# EAGLE design HiJack_Programmer (EAGLE 5.09)
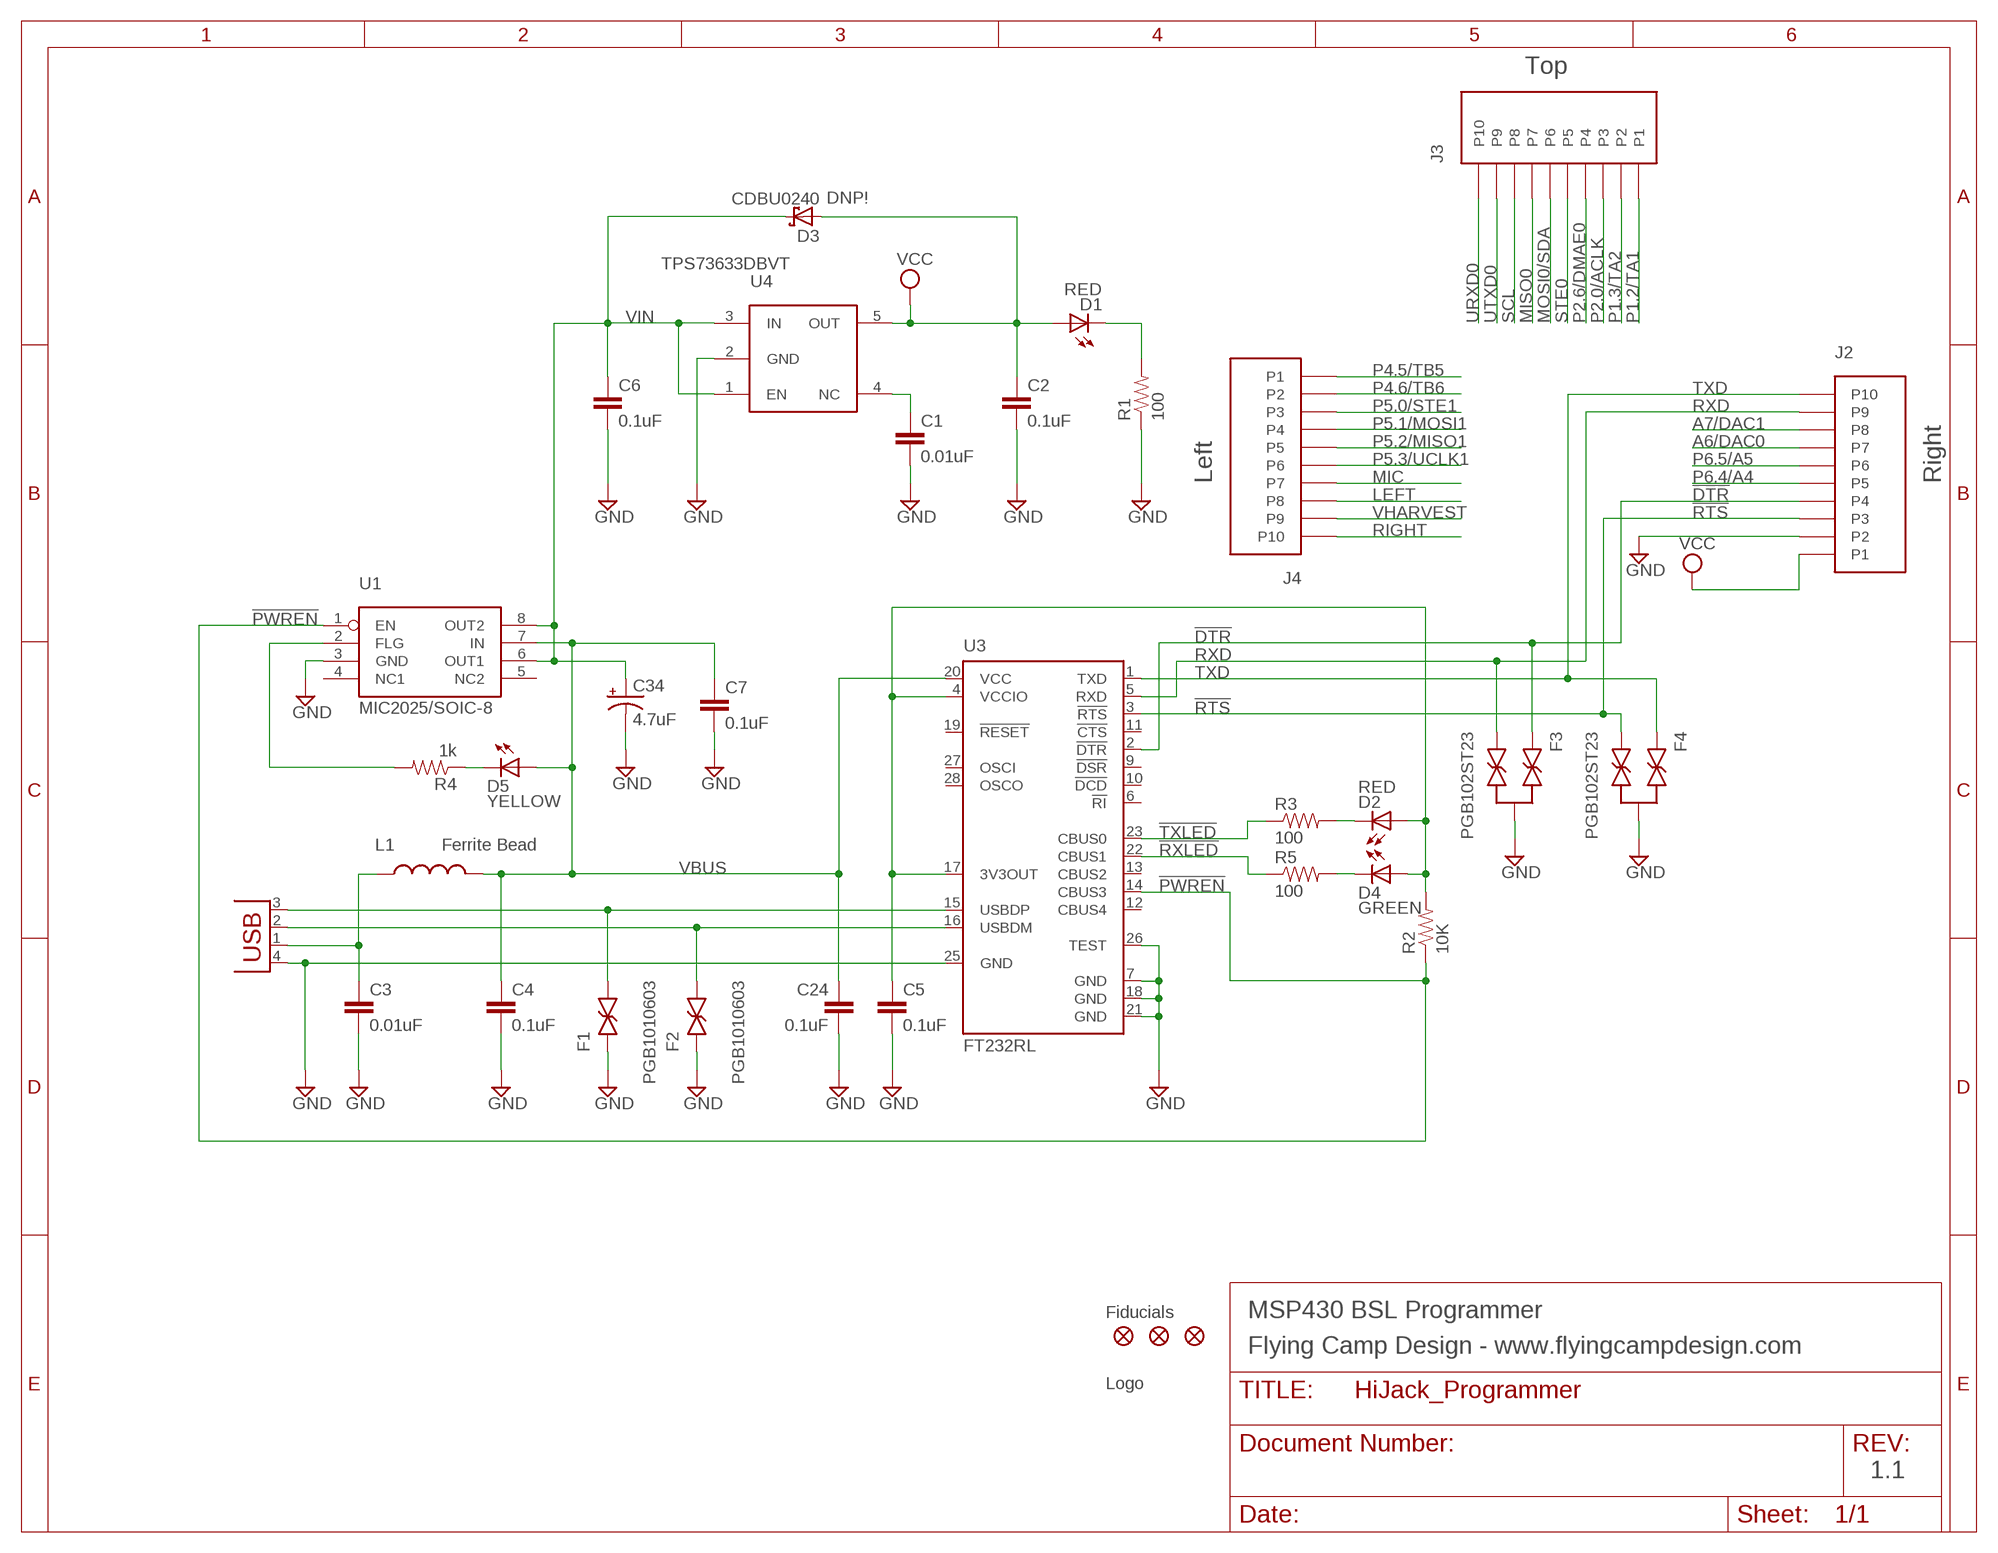
[diagram p0: schematic, sheet 1]

## Parts
C1  0.01uF  CAPACITOR1608  [CAPC1608]
C2  0.1uF  CAPACITOR1608  [CAPC1608]
C3  0.01uF  CAPACITOR1608  [CAPC1608]
C4  0.1uF  CAPACITOR1608  [CAPC1608]
C5  0.1uF  CAPACITOR1608  [CAPC1608]
C6  0.1uF  CAPACITOR1608  [CAPC1608]
C7  0.1uF  CAPACITOR1608  [CAPC1608]
C24  0.1uF  CAPACITOR1608  [CAPC1608]
C34  4.7uF  CAP_POL1206  [EIA3216]
D1  RED  LED1608  [LEDC1608]
D2  RED  LED1608  [LEDC1608]
D3  CDBU0240  SCHOTTKY-DIODE0603  [D0603]
D4  GREEN  LED1608  [LEDC1608]
D5  YELLOW  LED1608  [LEDC1608]
F1  PGB1010603  LITTELFUSE_PGB1010603  [CAPC1608]
F2  PGB1010603  LITTELFUSE_PGB1010603  [CAPC1608]
F3  PGB102ST23  LITTELFUSE_PGB102ST23  [SOT23]
F4  PGB102ST23  LITTELFUSE_PGB102ST23  [SOT23]
J2  HEADER10POS  [10PIN2MMHEADER]
J3  HEADER10POS  [10PIN2MMHEADER]
J4  HEADER10POS  [10PIN2MMHEADER]
L1  Ferrite Bead  INDUCTOR0603  [0603]
P1  MOLEX_48037-1000  [MOLEX_48037-1000]
R1  100  RESISTOR1608  [RESC1608]
R2  10K  RESISTOR1608  [RESC1608]
R3  100  RESISTOR1608  [RESC1608]
R4  1k  RESISTOR1608  [RESC1608]
R5  100  RESISTOR1608  [RESC1608]
U1  MIC2025/SOIC-8  [SOIC-8]
U3  FT232RL  [SSOP28]
U4  TPS73633DBVT  MIC5235SOT95P280-5  [SOT95P280-5]
U$2  FIDUCIAL1X2  [FIDUCIAL-1X2]
U$3  FIDUCIAL1X2  [FIDUCIAL-1X2]
U$4  FIDUCIAL1X2  [FIDUCIAL-1X2]

## Nets
!DTR: F3.1 J2.P4 U3.2(!DTR)
!PWREN: R2.1 U1.1(EN) U3.14(CBUS3)
!RTS: F4.2 J2.P3 U3.3(!RTS)
!RXLED: R5.1 U3.22(CBUS1)
!TXLED: R3.1 U3.23(CBUS0)
A6/DAC0: J2.P7
A7/DAC1: J2.P8
D+: F1.2 P1.3(D+) U3.15(USBDP)
D-: F2.2 P1.2(D-) U3.16(USBDM)
GND [power]: C1.2 C2.2 C3.2 C4.2 C5.2 C6.2 C7.2 C24.2 C34.C(-) F1.1 F2.1 F3.3 F4.3 J2.P2 P1.4(GND) R1.1 U1.3(GND) U3.7(GND) U3.18(GND) U3.21(GND) U3.25(GND) U3.26(TEST) U4.2(GND)
LEFT: J4.P8
MIC: J4.P7
MISO0: J3.P7
MOSI0/SDA: J3.P6
N$1: D1.C R1.2
N$2: C1.1 U4.4(NC)
N$3: R4.2 U1.2(FLG)
N$4: D5.C R4.1
N$34: D2.C R3.2
N$35: D4.C R5.2
P1.2/TA1: J3.P1
P1.3/TA2: J3.P2
P2.0/ACLK: J3.P3
P2.6/DMAE0: J3.P4
P4.5/TB5: J4.P1
P4.6/TB6: J4.P2
P5.0/STE1: J4.P3
P5.1/MOSI1: J4.P4
P5.2/MISO1: J4.P5
P5.3/UCLK1: J4.P6
P6.4/A4: J2.P5
P6.5/A5: J2.P6
RIGHT: J4.P10
RXD: F3.2 J2.P9 U3.5(RXD)
SCL: J3.P8
STE0: J3.P5
TXD: F4.1 J2.P10 U3.1(TXD)
URXD0: J3.P10
UTXD0: J3.P9
VBUS: C4.1 C7.1 C24.1 D5.A L1.2 U1.7(IN) U3.20(VCC)
VCC: C2.1 D1.A D3.A J2.P1 U4.5(OUT)
VCCIO: C5.1 D2.A D4.A R2.2 U3.4(VCCIO) U3.17(3V3OUT)
VHARVEST: J4.P9
VIN: C6.1 C34.A(+) D3.C U1.6(OUT1) U1.8(OUT2) U4.1(EN) U4.3(IN)
VUSB: C3.1 L1.1 P1.1(VBUS)
Unconnected: U1.4(NC1) U1.5(NC2) U3.6(!RI) U3.9(!DSR) U3.10(!DCD) U3.11(!CTS) U3.12(CBUS4) U3.13(CBUS2) U3.19(!RESET) U3.27(OSCI) U3.28(OSCO)

## Notes on the sheet
- Top
- DNP!
- Left | Right
- Fiducials | MSP430 BSL Programmer
- Flying Camp Design - www.flyingcampdesign.com
- Logo
- 1.1

## Library data of the parts
C1-C7 C24 = cwilson:CAPACITOR: Capacitor
C34 = SparkFun:CAP_POL: Capacitor Polarized These are standard SMD and PTH capacitors. Normally 10uF, 47uF, and 100uF in electrolytic and tantalum varieties. Always verify the external diameter of the through hole cap, it varies with capacity, voltage, and manufacturer. The EIA devices should be standard.
D1 D2 D4 D5 = cwilson:LED: LED
D3 = cwilson-old:SCHOTTKY-DIODE: Schottky Diode
F1 F2 = cwilson:LITTELFUSE_PGB1010603
F3 F4 = cwilson-old:LITTELFUSE_PGB102ST23
J2-J4 = hijack:HEADER10POS: Fits 3M 950510-6102-AR
L1 = SparkFun:INDUCTOR: Inductors Basic Inductor/Choke - 0603 and 1206. Footprints are not proven and vary greatly between part numbers.
P1 = cwilson-old:MOLEX_48037-1000
R1-R5 = cwilson:RESISTOR: Resistor
U1 = cwilson-old:MIC2025
U3 = cwilson-old:FT232R: Source: http://www.ftdichip.com/Documents/DataSheets/DS_FT232R_v104.pdf
U4 = cwilson:MIC5235
U$2-U$4 = SparkFun:FIDUCIAL: Fiducial Alignment Points Various fiducial points for machine vision alignment.

## Net classes
1 power: width 0.635 mm, clearance 0.406 mm

## Board
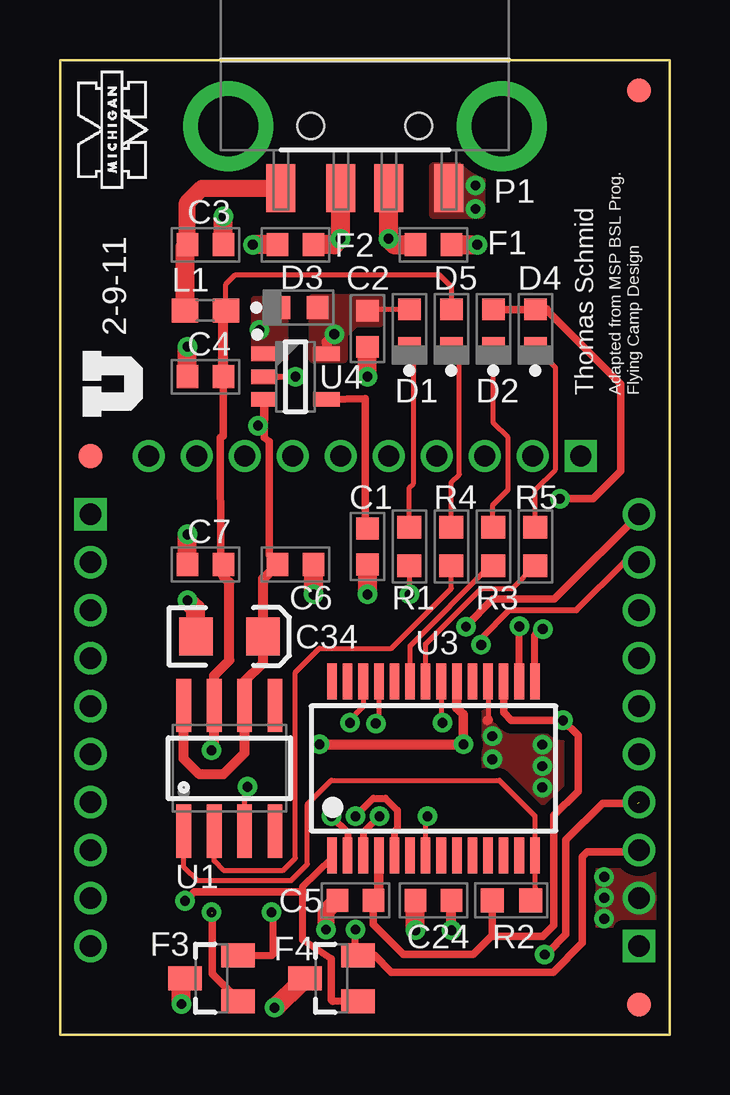
[diagram p1: board, top side]
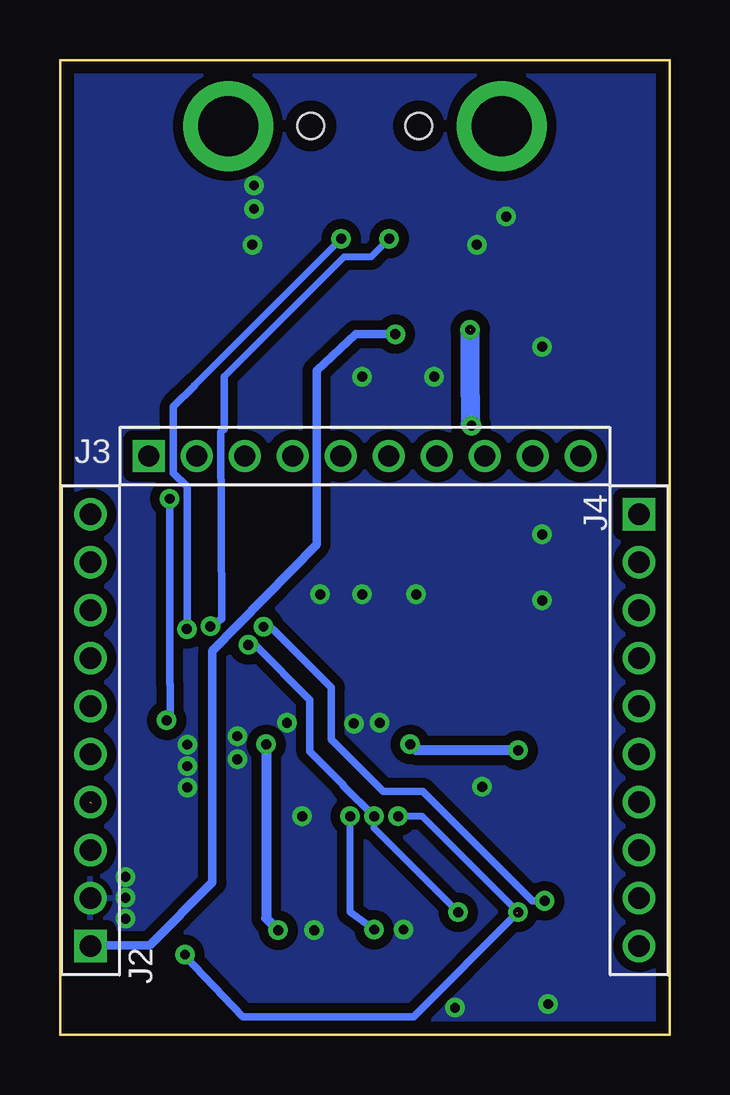
[diagram p2: board, bottom side, seen from below]

Size 25.4 x 40.64 mm. Coordinates in mm from the lower left corner, seen from the top.
Outline: 0,0 0,40.64 25.4,40.64 25.4,0 0,0
Copper layers (1*16): Top 0.0178mm / dielectric 1.4986mm / Bottom 0.0178mm
Design rules "SSC-EAGLE-2Lyr_v1.0.0.3 *": minimum track width 6mil, minimum drill 14mil, track to track 6mil, track to pad 6mil, pad to pad 6mil, via to via 6mil, smd to smd 6mil, copper to edge 20mil, drill to drill 16mil, minimum pad ring 8mil, minimum via ring 8mil, stop-mask expansion 3mil, vias tented up to drill 16mil, thermal gap 10mil

### Footprints (pad centres in the part's own frame; a part is rotated, then mirrored left to right if it is on the bottom)
CAPC1608 = smd 0.9 x 0.95: 1 -0.75,0; 2 0.75,0
EIA3216 = smd 1.4 x 1.6: A 1.4,0; C -1.4,0
LEDC1608 = smd 0.9 x 0.95: A 0.8,0; C -0.8,0
D0603 = smd 0.9 x 0.95: A 0.8,0; C -0.8,0
SOT23 = smd 1 x 1.4: 1 -0.95,-1.1; 2 0.95,-1.1; 3 0,1.1
10PIN2MMHEADER = drill 0.89 pad 1.346 square: P1 -9,0 | drill 0.89 pad 1.346 round: P2 -7,0; P3 -5,0; P4 -3,0; P5 -1,0; P6 1,0; P7 3,0; P8 5,0; P9 7,0; P10 9,0
0603 = smd 1.1 x 1: 1 -0.85,0; 2 0.85,0
MOLEX_48037-1000 = smd 1.2 x 2: 1 3.5,2.6; 2 1,2.6; 3 -1,2.6; 4 -3.5,2.6 | drill 2.5 pad 3.5 round: 5 5.7,0; 6 -5.7,0 | hole 1.1: -2.25,0; 2.25,0
RESC1608 = smd 0.95 x 1: 1 -0.8,0; 2 0.8,0
SOIC-8 = smd 0.61 x 2.21: 1 -1.905,-2.616; 2 -0.635,-2.616; 3 0.635,-2.616; 4 1.905,-2.616; 5 1.905,2.616; 6 0.635,2.616; 7 -0.635,2.616; 8 -1.905,2.616
SSOP28 = smd 0.4 x 1.5: 1 -4.225,-3.625; 2 -3.575,-3.625; 3 -2.925,-3.625; 4 -2.275,-3.625; 5 -1.625,-3.625; 6 -0.975,-3.625; 7 -0.325,-3.625; 8 0.325,-3.625; 9 0.975,-3.625; 10 1.625,-3.625; 11 2.275,-3.625; 12 2.925,-3.625; 13 3.575,-3.625; 14 4.225,-3.625; 15 4.225,3.625; 16 3.575,3.625; 17 2.925,3.625; 18 2.275,3.625; 19 1.625,3.625; 20 0.975,3.625; 21 0.325,3.625; 22 -0.325,3.625; 23 -0.975,3.625; 24 -1.625,3.625; 25 -2.275,3.625; 26 -2.925,3.625; 27 -3.575,3.625; 28 -4.225,3.625
SOT95P280-5 = smd 1.1 x 0.6: 1 -1.3,0.95; 2 -1.3,0; 3 -1.3,-0.95; 4 1.3,-0.95; 5 1.3,0.95
FIDUCIAL-1X2 = smd 1 x 1: 1 0,0

### Placement (x,y rotation side)
C1  12.81,20.36 270 top
C2  12.81,29.44 270 top
C3  6.06,32.94 0 top
C4  6.06,27.44 180 top
C5  12.31,5.61 180 top
C6  9.81,19.61 0 top
C7  6.06,19.61 180 top
C24  15.56,5.61 180 top
C34  7.06,16.61 0 top
D1  14.56,29.44 90 top
D2  18.06,29.44 90 top
D3  9.94,30.32 0 top
D4  19.81,29.44 90 top
D5  16.31,29.44 90 top
F1  15.56,32.94 180 top
F2  9.81,32.94 0 top
F3  6.31,2.36 90 top
F4  11.31,2.36 90 top
J2  24.13,12.7 90 bottom
J3  12.7,24.13 0 bottom
J4  1.27,12.7 270 bottom
L1  6.06,30.19 0 top
P1  12.7,37.89 180 top
R1  14.56,20.36 90 top
R2  18.81,5.61 180 top
R3  18.06,20.36 90 top
R4  16.31,20.36 270 top
R5  19.81,20.36 90 top
U1  7.06,11.11 0 top
U3  15.56,11.11 0 top
U4  9.81,27.44 0 top
U$1  [UMICH]  3.84,35.2 90 top
U$2  1.27,24.13 0 top
U$3  24.13,39.37 0 top
U$4  24.13,1.27 0 top
U$5  [UTAH_LOGO]  3.43,25.78 90 top

### Tracks (layer width: path | path; a pad name or v marks a point on that pad's centre or on a via)
!DTR  (via drill 0.41)  (2 unrouted)
  Top 0.3: U3.2 11.98,8.44 v11.31,9.11
  Top 0.305: F3.1 7.41,1.48 6.35,2.54 6.35,5.07 v6.31,5.11 | 20.32,3.43 21.08,4.19 21.08,8.13 22.61,9.65 24.08,9.65
  Top 0.406: v20.19,3.35 20.32,3.43
  Bottom 0.3: v11.31,9.11 10.31,9.11 v6.31,5.11
  Bottom 0.305: 6.35,5.08 10.67,0.76 17.78,0.76 20.19,3.3 v20.19,3.35
!PWREN
  Top 0.1: 19.79,6.08 19.81,6.11
  Top 0.2: 19.79,5.93 U3.14 19.79,9.13 18.31,10.61 11.31,10.61 10.31,9.61 10.31,7.11 9.64,6.44 5.73,6.44 5.16,7.01 U1.1
  Top 0.203: 19.79,6.08 19.79,5.93 19.79,5.79 R2.1 19.61,5.66 19.81,5.86 19.81,6.11
!RTS  (via drill 0.41)
  Top 0.2: F4.2 12.31,3.41
  Top 0.254: 24.05,7.62 J2.P3
  Top 0.3: U3.3 12.63,8.44 v13.31,9.11 | 12.31,3.41 v12.31,4.39 | F4.2 13.11,3.31
  Top 0.305: 13.11,3.31 13.81,2.61 20.54,2.61 21.77,3.83 21.77,7.42 21.97,7.62 24.05,7.62
  Bottom 0.3: v13.31,9.11 13.31,5.11 v12.31,4.39
!RXLED
  Top 0.2: R5.1 18.86,18.61 17.55,18.61 15.23,16.3
  Top 0.203: U3.22 15.23,16.3
!TXLED
  Top 0.2: R3.1 18.06,19.36
  Top 0.203: U3.23 14.59,16.21 17.93,19.56
  Top 0.305: 17.93,19.56 R3.1
D+  (via drill 0.41)
  Top 0.3: U3.15 19.79,16.69 v20.11,16.92
  Top 0.8: P1.3 13.7,33.2 v13.69,33.19 13.94,32.94 F1.2
  Bottom 0.3: 19.81,27.07 v13.69,33.19
  Bottom 0.305: 19.81,27.07 19.81,27.05 20.68,26.19 20.68,23.42 20.09,22.86 20.09,16.92 v20.11,16.92
D-  (via drill 0.41)
  Top 0.3: U3.16 19.14,16.9 v19.14,17.03
  Top 0.8: F2.2 11.44,32.94 v11.69,33.19 11.7,33.2 P1.2
  Bottom 0.3: v11.69,33.19 12.44,32.44 13.56,32.44 18.55,27.45
  Bottom 0.305: 18.55,27.45 18.55,25.26 18.69,25.12 18.67,17.34 v19.14,17.03
GND  (via drill 0.41)
  Top 0.203: R1.1 v14.56,18.36 | U3.25 13.29,13.13 v13.16,12.98 | U3.21 15.88,13.19 v15.94,13.01 | U3.18 17.84,13.13 | U3.7 15.23,9.04 | U3.26 12.63,13.69 12.31,13.36 v12.08,13.01 | U1.3 7.7,10.22 v7.81,10.34
  Top 0.254: U4.2 v9.81,27.44 | 15.23,9.04 v15.31,9.11
  Top 0.4: 17.84,13.13 17.81,13.11
  Top 0.711: C5.2 11.1,5.19 11.09,5.17 v11.09,4.38
  Top 0.8: v12.81,27.44 C2.2 | C1.2 v12.81,18.36 | C3.2 v6.81,34.11 | C4.2 v5.31,28.69 | C7.2 v5.31,20.86 | C6.2 v10.56,18.36 | v14.81,4.36 C24.2 | v5.06,1.28 5.06,2.21 F3.3 | v8.94,1.13 10.06,2.21 F4.3 | F2.1 v8.04,32.94 | F1.1 v17.39,32.94 | C34.C 5.66,17.76 v5.31,18.11
  other vias: 17.31,35.41 22.67,6.59 22.67,4.84 17.31,34.44 22.67,5.71 18.01,12.45 18.01,11.48 20.1,12.09 20.1,11.21 20.1,10.32
  pour Bottom (isolate 0.25): 25.4,40.64 25.4,0 0,0 0,40.64
  pour Top (no thermals): 22.24,6.83 22.24,4.59 25.13,4.59 25.13,6.83
  pour Top (no thermals): 15.56,36.19 17.56,36.19 17.56,34.19 15.56,34.19
  pour Top: 17.65,13.46 17.65,9.53 21.59,9.53 21.59,13.46
N$1
  Top 0.203: R1.2 14.56,22.82 14.73,22.99 14.73,28.47 D1.C
N$2
  Top 0.305: U4.4 12.71,26.52 12.71,21.31
  Top 0.406: C1.1 12.71,21.31
N$3
  Top 0.2: R4.2 16.31,18.61 13.81,16.11 10.81,16.11 9.81,15.11 9.81,7.36 9.31,6.86 6.81,6.86 6.42,7.25 U1.2
N$4
  Top 0.203: R4.1 16.31,23.04 16.64,23.37 16.64,28.31 D5.C
N$34
  Top 0.203: D2.C 18.06,25.5 18.67,24.89 18.67,22.73 18.03,22.1 18.03,21.19 R3.2
N$35
  Top 0.203: R5.2 19.81,22.73 20.65,23.57 20.65,27.8 D4.C
RXD  (via drill 0.41)
  Top 0.2: 8.84,3.31 8.89,3.36
  Top 0.254: v17.55,16.26 17.55,16.54 18.72,17.7 21.51,17.7 23.51,19.7 J2.P9
  Top 0.3: 8.89,3.36 8.89,5.03 v8.81,5.11 | F3.2 8.84,3.31 | v12.31,9.11 13.06,9.86 13.56,9.86 14.06,9.36 14.06,8.61 13.94,8.48 U3.5
  Bottom 0.3: v12.31,9.11 12.31,8.61 v8.81,5.11
  Bottom 0.305: v12.31,9.11 13.59,10.39 13.59,10.41 14.99,11.81 14.99,13.97 17.27,16.26 v17.55,16.26
TXD  (via drill 0.41)
  Top 0.2: 11.34,7.38 U3.1
  Top 0.3: 11.34,7.38 10.11,6.18 10.11,5.97 10.11,3.96 11.31,3.16 | F4.1 11.36,1.41
  Top 0.305: 11.31,3.16 11.31,1.46 11.36,1.41 | v5.21,5.59 5.59,5.97 10.11,5.97 | v16.92,17.02 18.03,18.16 20.6,18.16 20.85,18.41 20.84,18.41 J2.P10
  Bottom 0.305: v5.21,5.59 5.71,5.59 10.29,10.16 11.94,10.16 14.1,12.32 14.1,14.48 16.51,16.89 16.92,17.04 v16.92,17.02
VBUS  (via drill 0.41)
  Top 0.2: 6.91,30.29 L1.2 6.91,31.29 7.31,31.69 15.81,31.69 16.31,31.19 D5.A
  Top 0.305: C4.1 6.81,24.97 6.68,24.89 6.71,19.69
  Top 0.4: U3.20 16.54,13.63 16.81,13.36 v16.81,12.11
  Top 0.406: v16.31,4.36 C24.1 | v6.31,11.86 6.42,11.97 U1.7 6.42,14.97 7.06,15.61 7.06,18.86 6.81,19.11 C7.1 6.71,19.69 | v10.81,12.11 v16.81,12.11 | C4.1 6.81,30.09
  Top 0.6: 6.81,30.09 L1.2
  Bottom 0.406: v6.31,11.86 10.56,11.86 v10.81,12.11 | v16.81,12.11 16.81,4.86 v16.31,4.36
VCC  (via drill 0.41)
  Top 0.2: D1.A 12.86,30.24
  Top 0.4: 12.86,30.24 C2.1
  Top 0.406: U4.5 11.11,28.89 v11.43,29.21
  Bottom 0.254: 24.1,3.73 J2.P1
  Bottom 0.356: v11.43,29.21 13.08,29.21 14.71,27.69 14.71,20.45 19.05,16 19.05,6.35 21.67,3.73 24.1,3.73
  pour Top (no thermals): 10.56,30.69 13.31,30.69 13.31,29.69 12.31,29.69 11.81,29.19 11.81,28.19 10.56,28.19
VCCIO  (via drill 0.41)
  Top 0.2: 18.01,4.16 18.06,4.11 | C5.1 13.29,5.83
  Top 0.305: U3.17 18.48,13.44 18.81,13.11 v20.95,13.11 21.59,12.47 21.59,10.16 20.57,9.14 20.57,4.57 20.11,4.11 18.06,4.11 | R2.2 18.01,4.16 17.21,3.36 14.31,3.36 13.06,4.61 C5.1 | D4.A D2.A | 20.81,22.37 v20.83,22.35 22.23,22.35 23.37,23.5 23.37,27.13 20.26,30.24
  Top 0.4: 13.29,5.83 U3.4 | 20.26,30.24 D4.A
  Bottom 0.305: v20.83,22.35 20.83,14.63 20.81,14.62 20.81,13.35 v20.95,13.11
VIN  (via drill 0.41)  (1 unrouted)
  Top 0.305: U4.3 8.51,24.89 8.71,24.74 8.71,20.01 C6.1
  Top 0.356: U4.3 8.51,25.66 v8.26,25.4
  Top 0.406: U1.8 5.16,11.52 5.81,10.86 6.81,10.86 7.7,11.74 U1.6 7.7,14.74 8.46,15.51 C34.A 8.46,19.01 C6.1
  Bottom 0.406: v8.26,25.4 8.26,26.61 8.31,26.67
  Bottom 0.8: 8.31,25.45 8.31,26.67 8.31,29.38
  other vias: 8.31,29.39
  pour Top (no thermals): 8.06,30.69 8.06,28.19 9.44,28.19 9.44,30.69
VUSB
  Top 0.711: C3.1 5.31,34.69 5.91,35.29 P1.1
  Top 0.8: L1.1 5.21,32.84 C3.1

### Text on the board
tPlace: 2-9-11 | Thomas Schmid | Adapted from MSP BSL Prog. | Flying Camp Design